# EAGLE design CatNode (EAGLE 9.5.2)
CREVISION: v1.0; DESIGNER: ThoMo
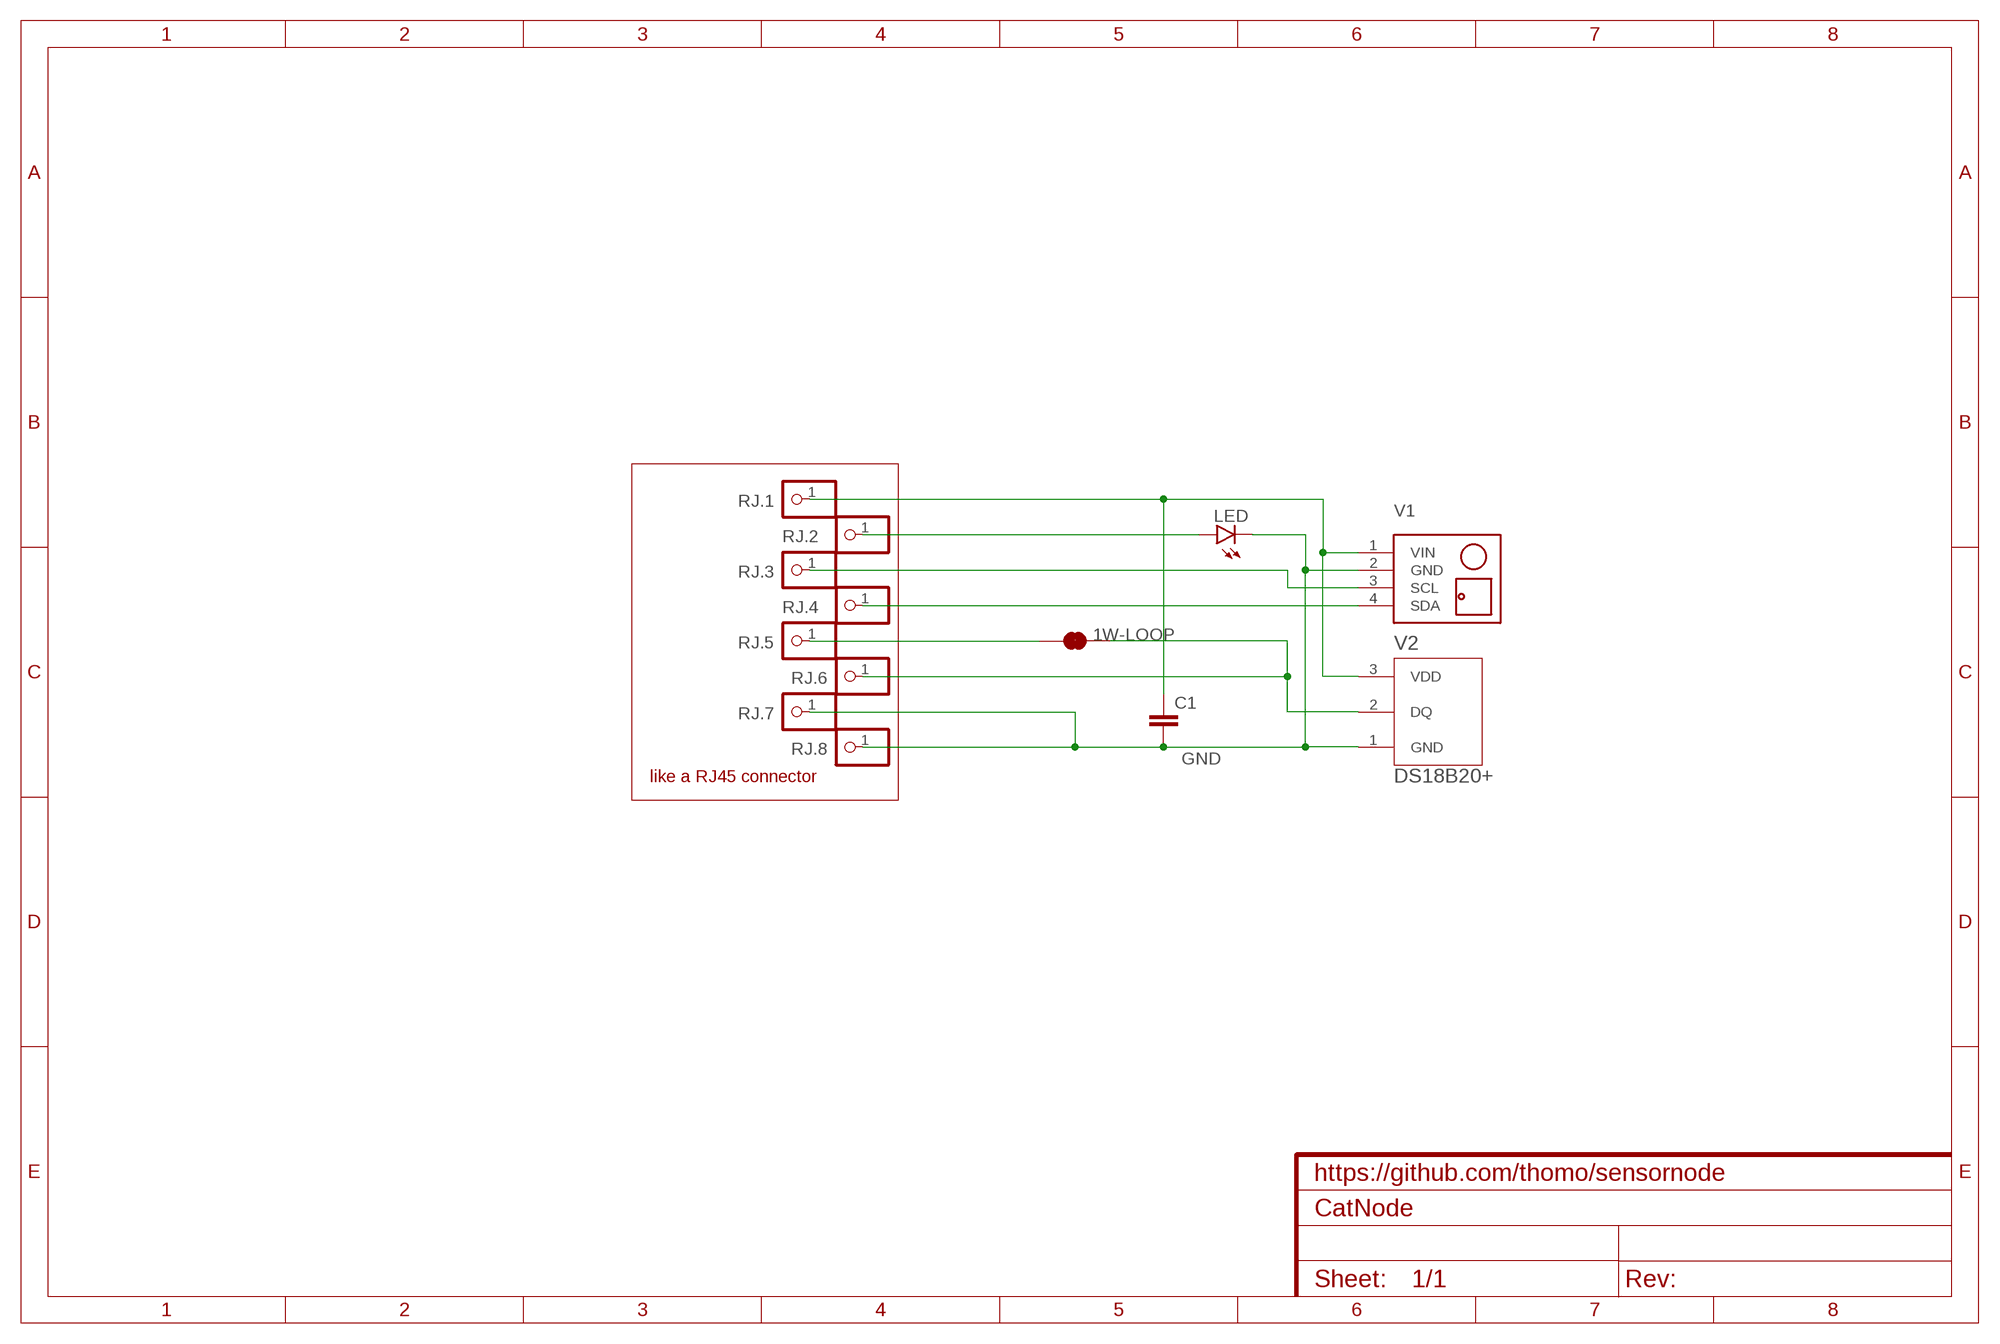
[diagram p0: schematic, sheet 1]
FRAME2 (FRAME-A4L): CNAME: https://github.com/thomo/sensornode

## Parts
1W-LOOP  JUMPER-SMT_2_NC_TRACE_SILK  [SMT-JUMPER_2_NC_TRACE_SILK]
C1  C-EUC0805  [C0805]
LED  LEDSML0805  [SML0805]
RJ.1  PINHD-1X1  [1X01]
RJ.2  PINHD-1X1  [1X01]
RJ.3  PINHD-1X1  [1X01]
RJ.4  PINHD-1X1  [1X01]
RJ.5  PINHD-1X1  [1X01]
RJ.6  PINHD-1X1  [1X01]
RJ.7  PINHD-1X1  [1X01]
RJ.8  PINHD-1X1  [1X01]
V1  TEMP-HUM-PRES-BME280  [TEMP-HUM-PRES-BME280]
V2  DS18B20+  [TO-92]

## Nets
GND: C1.2 LED.C RJ.7.1 RJ.8.1 V1.2(GND) V2.1(GND)
N$1: C1.1 RJ.1.1 V1.1(VIN) V2.3(VDD)
N$3: RJ.4.1 V1.4(SDA)
N$4: LED.A RJ.2.1
N$5: RJ.3.1 V1.3(SCL)
N$10: 1W-LOOP.1 RJ.5.1
N$12: 1W-LOOP.2 RJ.6.1 V2.2(DQ)

## Notes on the sheet
- like a RJ45 connector

## Library data of the parts
1W-LOOP = SparkFun-Jumpers:JUMPER-SMT_2_NC_TRACE: Normally closed trace jumper This jumper has a trace between two pads so it's normally closed (NC). Use a razor knife to open the connection. For best results follow the IPC guidelines for cutting traces: Cutout at least 0.063 mm (0.005 in). Remove all loose material to clean up the cut area. Seal the cut with an approved epoxy. Reapply solder to reclose the connection.
C1 = rcl:C-EU: CAPACITOR, European symbol; SPICEPREFIX: C
LED = led:LED: LED OSRAM: - CHIPLED LG R971, LG N971, LY N971, LG Q971, LY Q971, LO R971, LY R971 LH N974, LH R974 LS Q976, LO Q976, LY Q976 LO Q996 - Hyper CHIPLED LW Q18S LB Q993, LB Q99A, LB R99A - SideLED LS A670, LO A670, LY A670, LG A670, LP A670 LB A673, LV A673, LT A673, LW A673 LH A674 LY A675 LS A676, LA A676, LO A676, LY A676, LW A676 LS A679, LY A679, LG A679 - Hyper Micro SIDELED® LS Y876, LA Y876, LO Y876, LY Y876 LT Y87S - SmartLED LW L88C, LW L88S LB L89C, LB L89S, LG L890 LS L89K, LO L89K, LY L89K LS L896, LA L896, LO L896, LY L896 - TOPLED LS T670, LO T670, LY T670, LG T670, LP T670 LSG T670, LSP T670, LSY T670, LOP T670, LYG T670 LG T671, LOG T671, LSG T671 LB T673, LV T673, LT T673, LW T673 LH T674 LS T676, LA T676, LO T676, LY T676, LB T676, LH T676, LSB T676, LW T676 LB T67C, LV T67C, LT T67C, LS T67K, LO T67K, LY T67K, LW E67C LS E67B, LA E67B, LO E67B, LY E67B, LB E67C, LV E67C, LT E67C LW T67C LS T679, LY T679, LG T679 LS T770, LO T770, LY T770, LG T770, LP T770 LB T773, LV T773, LT T773, LW T773 LH T774 LS E675, LA E675, LY E675, LS T675 LS T776, LA T776, LO T776, LY T776, LB T776 LHGB T686 LT T68C, LB T68C - Hyper Mini TOPLED® LB M676 - Mini TOPLED Santana® LG M470 LS M47K, LO M47K, LY M47K Source: http://www.osram.convergy.de LUXEON: - LUMILED® LXK2-PW12-R00, LXK2-PW12-S00, LXK2-PW14-U00, LXK2-PW14-V00 LXK2-PM12-R00, LXK2-PM12-S00, LXK2-PM14-U00 LXK2-PE12-Q00, LXK2-PE12-R00, LXK2-PE12-S00, LXK2-PE14-T00, LXK2-PE14-U00 LXK2-PB12-K00, LXK2-PB12-L00, LXK2-PB12-M00, LXK2-PB14-N00, LXK2-PB14-P00, LXK2-PB14-Q00 LXK2-PR12-L00, LXK2-PR12-M00, LXK2-PR14-Q00, LXK2-PR14-R00 LXK2-PD12-Q00, LXK2-PD12-R00, LXK2-PD12-S00 LXK2-PH12-R00, LXK2-PH12-S00 LXK2-PL12-P00, LXK2-PL12-Q00, LXK2-PL12-R00 Source: www.luxeon.com KINGBRIGHT: KA-3528ASYC Source: www.kingbright.com
RJ.1-RJ.8 = pinhead:PINHD-1X1: PIN HEADER
V1 = thomo:TEMP-HUM-PRES-BME280: Digital Humidity-Temperature-Pressure Sensor based on BME280 device More information about BME280 device is available here: https://www.bosch-sensortec.com/bst/products/all_products/bme280 Click here to find device on ebay.com <http://www.ebay.com/sch/bme280+breakout>
V2 = thomo:DS18B20+: 1wire Temp Sensor; MANUFACTURER_PART_NUMBER: DS18B20+; VENDOR: Maxim Integrated Products

## Board
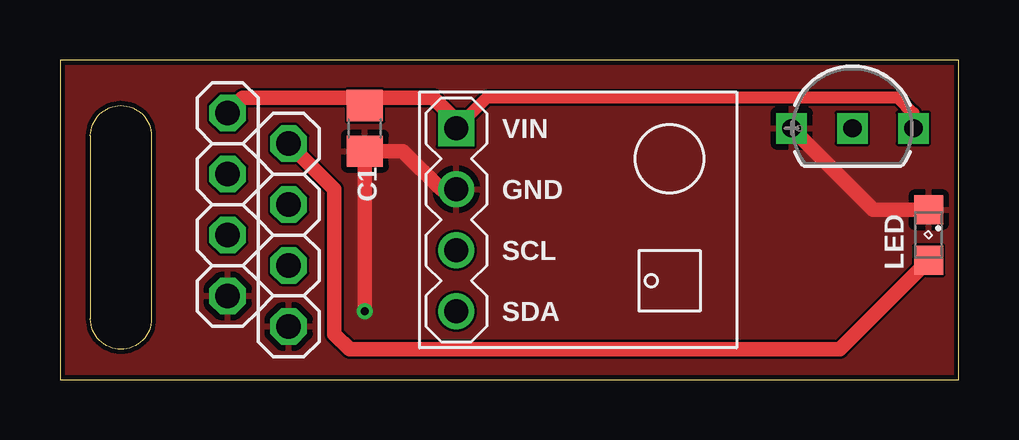
[diagram p1: board, top side]
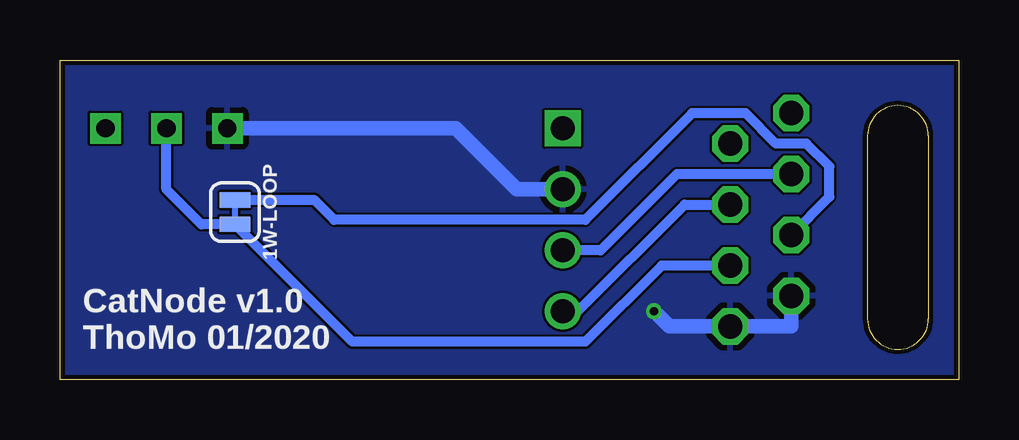
[diagram p2: board, bottom side, seen from below]

Size 37.45 x 13.32 mm. Coordinates in mm from the lower left corner, seen from the top.
Outline: 0,0 37.45,0 37.45,13.32 0,13.32 0,0
Outline: 1.27,10.16 1.27,2.54 arc180 3.81,2.54 3.81,10.16 arc180 1.27,10.16
Copper layers (1*16): Top 0.035mm / dielectric 1.5mm / Bottom 0.035mm
Design rules "aisler_2_layer": minimum track width 0.1mm, minimum drill 0.2mm, track to track 0.1mm, track to pad 0.1mm, pad to pad 0.1mm, via to via 0.1mm, smd to smd 0.1mm, copper to edge 0.2mm, drill to drill 0.21mm, minimum pad ring 0.25mm, minimum via ring 0.15mm, stop-mask expansion 0mil, vias tented up to drill 0mil, thermal gap 10mil

### Footprints (pad centres in the part's own frame; a part is rotated, then mirrored left to right if it is on the bottom)
SMT-JUMPER_2_NC_TRACE_SILK = smd 0.635 x 1.27: 1 -0.508,0; 2 0.508,0
C0805 = smd 1.3 x 1.5: 1 -0.95,0; 2 0.95,0
SML0805 = smd 1.2 x 1.2: A 1.05,0; C -1.05,0
1X01 = drill 1.016 octagon: 1 0,0
TEMP-HUM-PRES-BME280 = drill 1 square: 1 -5.08,3.81 | drill 1: 2 -5.08,1.27; 3 -5.08,-1.27; 4 -5.08,-3.81
TO-92 = drill 0.762 pad 1.27 square: 1 -5.08,0; 2 -2.54,0; 3 0,0

### Placement (x,y rotation side)
1W-LOOP  30.16,6.99 270 bottom
C1  12.7,10.48 270 top
LED  36.2,6.03 270 top
RJ.1  6.99,11.11 0 top
RJ.2  9.53,9.84 0 top
RJ.3  6.99,8.57 0 top
RJ.4  9.53,7.3 0 top
RJ.5  6.99,6.03 0 top
RJ.6  9.53,4.76 0 top
RJ.7  6.99,3.49 0 top
RJ.8  9.53,2.22 0 top
V1  21.59,6.67 0 top
V2  35.56,10.48 0 top

### Tracks (layer width: path | path; a pad name or v marks a point on that pad's centre or on a via)
GND  (via drill 0.35)
  Top 0.61: V1.2 15.88,7.94 14.29,9.53 C1.2 v12.7,2.86 | LED.C 33.88,7.08 V2.1
  Bottom 0.61: V1.2 18.41,7.94 20.95,10.48 V2.1 | RJ.7.1 6.99,2.22 RJ.8.1 12.06,2.22 v12.7,2.86
  pour Top: 0,13.34 0,0 37.47,0 37.47,13.34
  pour Bottom: 0,13.34 0,0 37.47,0 37.47,13.34
N$1
  Top 0.508: V1.1 17.78,11.75 34.92,11.75 35.56,11.11 V2.3
  Top 0.61: RJ.1.1 7.62,11.75 12.38,11.75 C1.1 13.02,11.75 15.56,11.75 16.51,10.79 V1.1
N$3
  Bottom 0.406: RJ.4.1 11.43,7.3 15.88,2.86 V1.4
N$4
  Top 0.61: RJ.2.1 11.43,7.94 11.43,1.91 12.06,1.27 32.48,1.27 LED.A
N$5
  Bottom 0.406: RJ.3.1 11.75,8.57 14.92,5.4 V1.3
N$10
  Bottom 0.406: 1W-LOOP.1 26.86,7.49 26.04,6.67 15.56,6.67 11.11,11.11 8.89,11.11 7.62,9.84 6.35,9.84 5.4,8.89 5.4,7.62 RJ.5.1
N$12
  Bottom 0.406: V2.2 33.02,7.94 31.56,6.48 1W-LOOP.2 25.27,1.59 15.56,1.59 12.38,4.76 RJ.6.1

### Text on the board
bPlace: CatNode v1.0 / ThoMo 01/2020